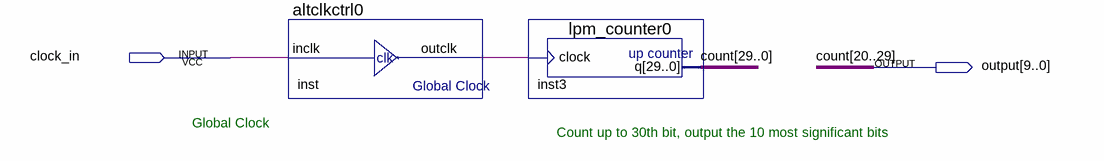
[diagram p0: schematic sheet]
// Quartus schematic blinkenlights.bdf as structural Verilog: 2 symbols, 2 pins
module blinkenlights (
  input  clock_in,
  output [9:0] \output 
);

  wire inst_outclk;
  wire [19:0] count;

  altclkctrl0 inst (.inclk(clock_in), .outclk(inst_outclk));
  lpm_counter0 inst3 (
    .clock(inst_outclk),
    .q({\output [0], \output [1], \output [2], \output [3], \output [4], \output [5], \output [6], \output [7], \output [8], \output [9], count}));

  // Other names for the same wires on the sheet: count[29:20] = {\output [0], \output [1], \output [2], \output [3], \output [4], \output [5], \output [6], \output [7], \output [8], \output [9]}

  // Notes on the sheet:
  //   Global Clock
  //   Count up to 30th bit, output the 10 most significant bits
endmodule
